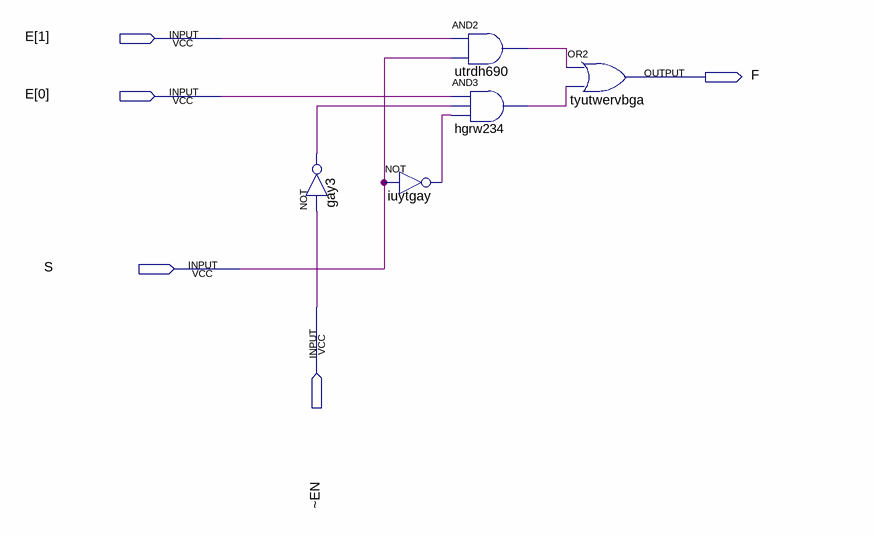
[diagram p0: schematic sheet]
// Quartus schematic mux2-en.bdf as structural Verilog: 5 symbols, 5 pins
module \mux2-en  (
  input  [1:0] E,
  input  S,
  input  \~EN ,
  output F
);

  wire gay3_out, hgrw234_out, iuytgay_out, utrdh690_out;

  not gay3 (gay3_out, \~EN );
  not iuytgay (iuytgay_out, S);
  and utrdh690 (utrdh690_out, E[1], S);
  and hgrw234 (hgrw234_out, E[0], gay3_out, iuytgay_out);
  or tyutwervbga (F, utrdh690_out, hgrw234_out);
endmodule
